# Altium schematic sheet TP_IHM_7SEG.SchDoc
size A4
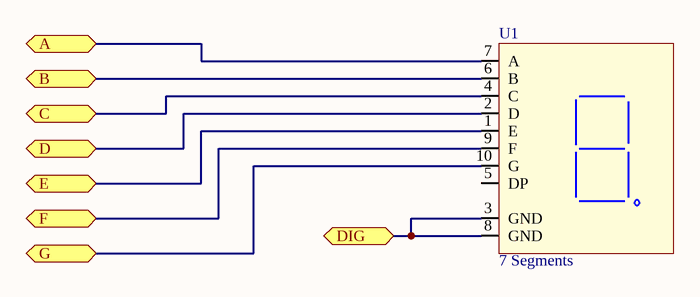
[diagram p0: TP_IHM_7SEG.SchDoc]

## Parts
U1  7 Segments  [SA10-21GWA]

## Ports
A, B, C, D, DIG, E, F, G

## Nets
A: U1.7(A) ; port A
B: U1.6(B) ; port B
C: U1.4(C) ; port C
D: U1.2(D) ; port D
DIG: U1.3(GND) U1.8(GND) ; port DIG
E: U1.1(E) ; port E
F: U1.9(F) ; port F
G: U1.10(G) ; port G

Not connected (* = marked no-connect by the designer): U1 5(DP)

## Library data of the parts
U1 = SC10-21SRWA: KingBright Led 7 Segments; Reference: SC10-21SRWA